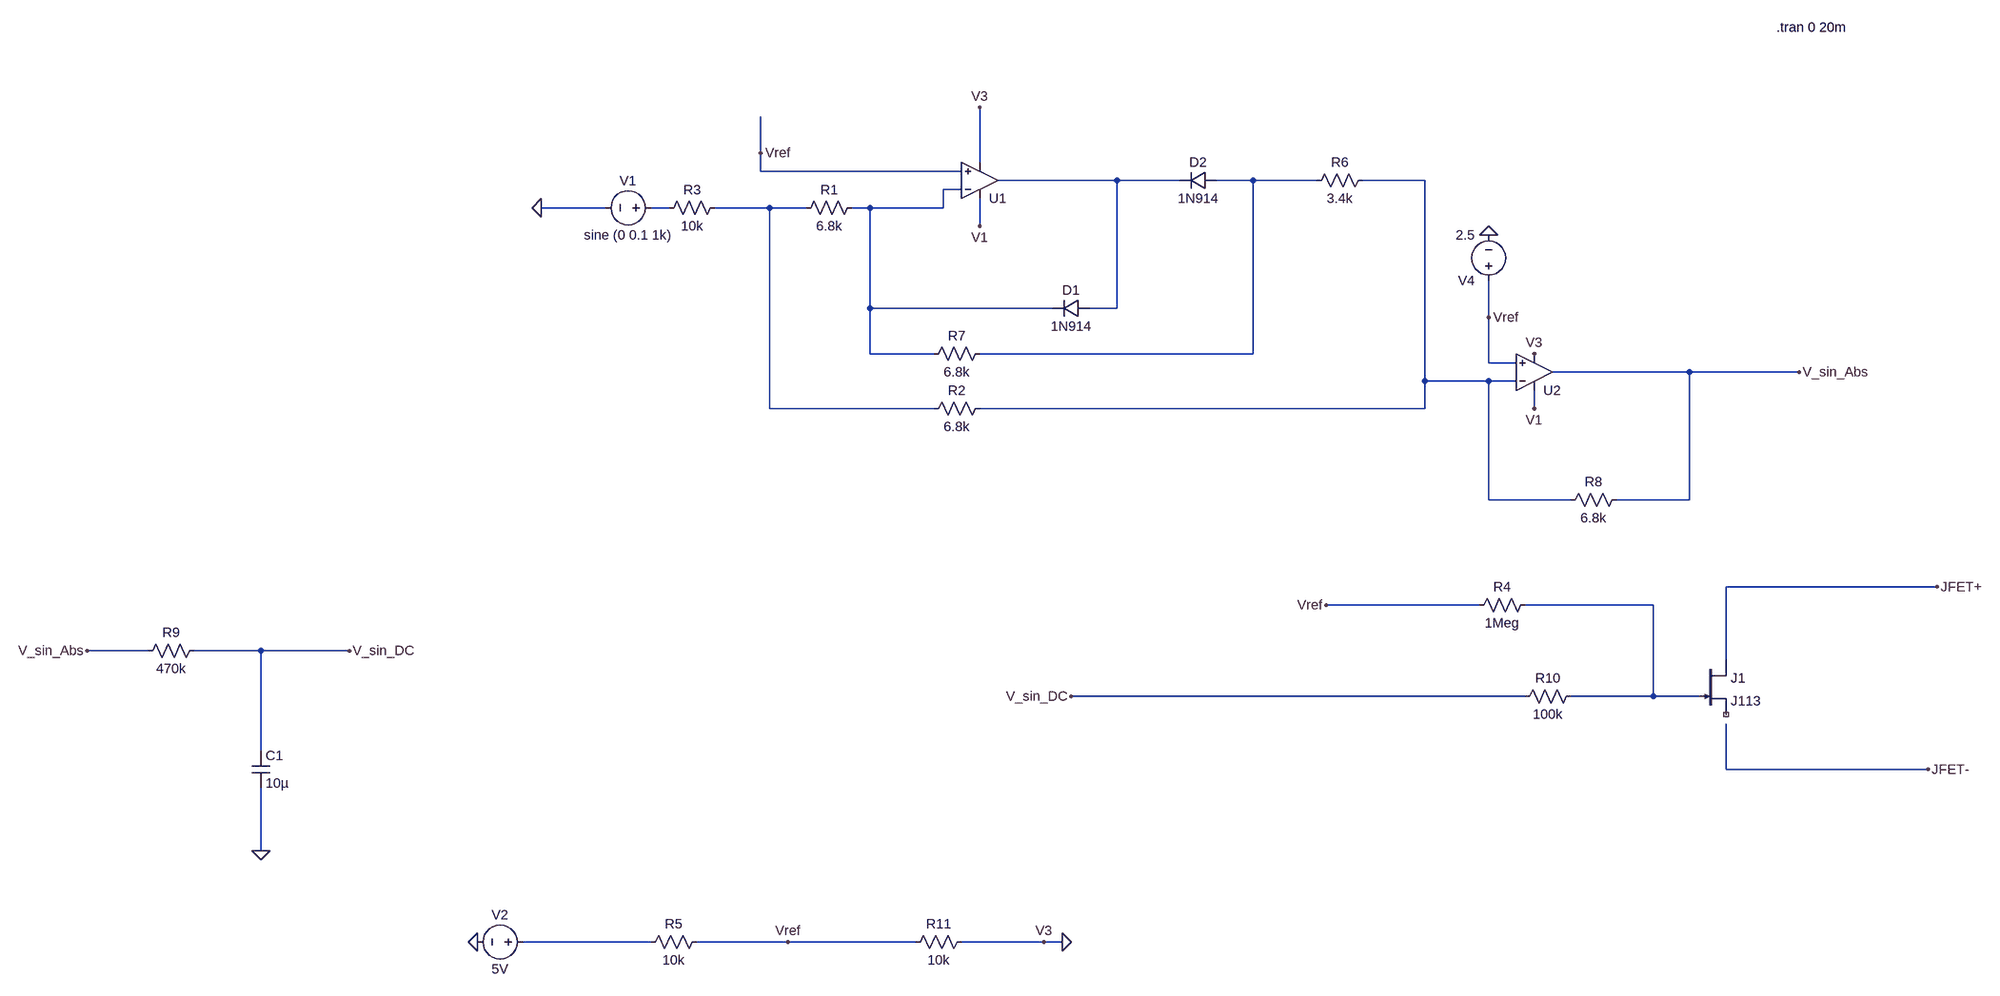
[diagram p0: schematic JFET simulation finished.asc]
JFET simulation finished.asc, the LTspice schematic file:
Version 4.1
SHEET 1 1784 1776
WIRE -448 224 -448 160
WIRE -64 240 -64 144
WIRE -448 256 -448 224
WIRE -96 256 -448 256
WIRE 176 272 -32 272
WIRE 288 272 176 272
WIRE 416 272 352 272
WIRE 528 272 416 272
WIRE 720 272 608 272
WIRE -96 288 -128 288
WIRE -720 320 -832 320
WIRE -608 320 -640 320
WIRE -432 320 -528 320
WIRE -368 320 -432 320
WIRE -256 320 -288 320
WIRE -128 320 -128 288
WIRE -128 320 -256 320
WIRE -64 352 -64 304
WIRE -256 496 -256 320
WIRE 64 496 -256 496
WIRE 176 496 176 272
WIRE 176 496 128 496
WIRE 832 512 832 448
WIRE -256 576 -256 496
WIRE -144 576 -256 576
WIRE 416 576 416 272
WIRE 416 576 -64 576
WIRE 832 592 832 512
WIRE 880 592 832 592
WIRE 1184 608 944 608
WIRE 1376 608 1184 608
WIRE 720 624 720 272
WIRE 832 624 720 624
WIRE 880 624 832 624
WIRE -432 672 -432 320
WIRE -144 672 -432 672
WIRE 720 672 720 624
WIRE 720 672 -64 672
WIRE 912 672 912 640
WIRE 832 832 832 624
WIRE 976 832 832 832
WIRE 1184 832 1184 608
WIRE 1184 832 1056 832
WIRE 1696 1056 1248 1056
WIRE 816 1088 544 1088
WIRE 1120 1088 896 1088
WIRE -1872 1168 -2464 1168
WIRE -1568 1168 -1792 1168
WIRE -1168 1168 -1568 1168
WIRE 1248 1184 1248 1056
WIRE 896 1248 96 1248
WIRE 1120 1248 1120 1088
WIRE 1120 1248 976 1248
WIRE 1200 1248 1120 1248
WIRE -1568 1344 -1568 1168
WIRE 1248 1376 1248 1296
WIRE 1680 1376 1248 1376
WIRE -1568 1552 -1568 1408
WIRE -640 1712 -864 1712
WIRE -400 1712 -560 1712
WIRE -176 1712 -400 1712
WIRE 48 1712 -96 1712
WIRE 80 1712 48 1712
FLAG -1568 1552 0
FLAG -832 320 0
FLAG 832 368 0
FLAG 832 512 Vref
FLAG -448 224 Vref
FLAG 1376 608 V_sin_Abs
FLAG 1696 1056 JFET+
FLAG 1680 1376 JFET-
FLAG -2464 1168 V_sin_Abs
FLAG -1168 1168 V_sin_DC
FLAG 96 1248 V_sin_DC
FLAG 544 1088 Vref
FLAG -64 352 V1
FLAG 912 672 V1
FLAG 912 576 V3
FLAG -64 144 V3
FLAG 80 1712 0
FLAG -944 1712 0
FLAG -400 1712 Vref
FLAG 48 1712 V3
SYMBOL OpAmps\\UniversalOpAmp2 -64 272 M180
SYMATTR InstName U1
SYMBOL njf 1200 1184 R0
SYMATTR InstName J1
SYMATTR Value J113
SYMBOL res -272 304 R90
WINDOW 0 0 56 VBottom 2
WINDOW 3 32 56 VTop 2
SYMATTR InstName R1
SYMATTR Value 6.8k
SYMBOL res -48 656 R90
WINDOW 0 0 56 VBottom 2
WINDOW 3 32 56 VTop 2
SYMATTR InstName R2
SYMATTR Value 6.8k
SYMBOL res 624 256 R90
WINDOW 0 0 56 VBottom 2
WINDOW 3 32 56 VTop 2
SYMATTR InstName R6
SYMATTR Value 3.4k
SYMBOL res -48 560 R90
WINDOW 0 0 56 VBottom 2
WINDOW 3 32 56 VTop 2
SYMATTR InstName R7
SYMATTR Value 6.8k
SYMBOL res 1072 816 R90
WINDOW 0 0 56 VBottom 2
WINDOW 3 32 56 VTop 2
SYMATTR InstName R8
SYMATTR Value 6.8k
SYMBOL res -1776 1152 R90
WINDOW 0 0 56 VBottom 2
WINDOW 3 32 56 VTop 2
SYMATTR InstName R9
SYMATTR Value 470k
SYMBOL cap -1584 1344 R0
SYMATTR InstName C1
SYMATTR Value 10µ
SYMBOL diode 128 480 R90
WINDOW 0 0 32 VBottom 2
WINDOW 3 32 32 VTop 2
SYMATTR InstName D1
SYMATTR Value 1N914
SYMBOL diode 352 256 R90
WINDOW 0 0 32 VBottom 2
WINDOW 3 32 32 VTop 2
SYMATTR InstName D2
SYMATTR Value 1N914
SYMBOL res 992 1232 R90
WINDOW 0 0 56 VBottom 2
WINDOW 3 32 56 VTop 2
SYMATTR InstName R10
SYMATTR Value 100k
SYMBOL OpAmps\\UniversalOpAmp2 912 608 M180
SYMATTR InstName U2
SYMBOL voltage -624 320 R90
WINDOW 0 -32 56 VBottom 2
WINDOW 3 32 56 VTop 2
SYMATTR InstName V1
SYMATTR Value sine (0 0.1 1k)
SYMBOL voltage 832 464 R180
WINDOW 123 0 0 Left 0
WINDOW 39 0 0 Left 0
SYMATTR InstName V4
SYMATTR Value 2.5
SYMBOL res -512 304 R90
WINDOW 0 0 56 VBottom 2
WINDOW 3 32 56 VTop 2
SYMATTR InstName R3
SYMATTR Value 10k
SYMBOL res 912 1072 R90
WINDOW 0 0 56 VBottom 2
WINDOW 3 32 56 VTop 2
SYMATTR InstName R4
SYMATTR Value 1Meg
SYMBOL res -544 1696 R90
WINDOW 0 0 56 VBottom 2
WINDOW 3 32 56 VTop 2
SYMATTR InstName R5
SYMATTR Value 10k
SYMBOL res -80 1696 R90
WINDOW 0 0 56 VBottom 2
WINDOW 3 32 56 VTop 2
SYMATTR InstName R11
SYMATTR Value 10k
SYMBOL voltage -848 1712 R90
WINDOW 0 -32 56 VBottom 2
WINDOW 3 32 56 VTop 2
SYMATTR InstName V2
SYMATTR Value 5V
TEXT 1336 -80 Left 2 !.tran 0 20m

The netlist it stands for:
* JFET simulation finished.asc
X§U1 Vref N004 V1 0 N001 level2 Avol=1Meg GBW=10Meg Slew=10Meg Ilimit=25m Rail=0 Vos=0 En=0 Enk=0 In=0 Ink=0 Rin=500Meg  ; pins In+ In- V+ V- OUT
J1 JFET+ N007 NC_01 J113
R1 N004 N006 6.8k
R2 N003 N006 6.8k
R6 N003 N002 3.4k
R7 N002 N004 6.8k
R8 V_sin_Abs N003 6.8k
R9 V_sin_DC V_sin_Abs 470k
C1 V_sin_DC 0 10µ
D1 N001 N004 1N914
D2 N002 N001 1N914
R10 N007 V_sin_DC 100k
X§U2 Vref N003 V1 0 V_sin_Abs level2 Avol=1Meg GBW=10Meg Slew=10Meg Ilimit=25m Rail=0 Vos=0 En=0 Enk=0 In=0 Ink=0 Rin=500Meg  ; pins In+ In- V+ V- OUT
V1 N005 0 sine (0 0.1 1k)
V4 Vref 0 2.5
R3 N006 N005 10k
R4 N007 Vref 1Meg
R5 Vref N008 10k
R11 0 Vref 10k
V2 N008 0 5V
.model D D
.lib standard.dio
.model NJF NJF
.model PJF PJF
.lib standard.jft
.tran 0 20m
.lib UniversalOpAmp2.lib
.backanno
.end